# Altium schematic sheet NBT_JTAG_LOOP_CABLE.SCHDOC
size A4; Organization: Altium Limited; Address1: L3, 12a Rodborough Rd; Address2: Frenchs Forest; Address3: NSW; Address4: Australia 2086; DocumentNumber: 3; SheetNumber: 3; SheetTotal: 3
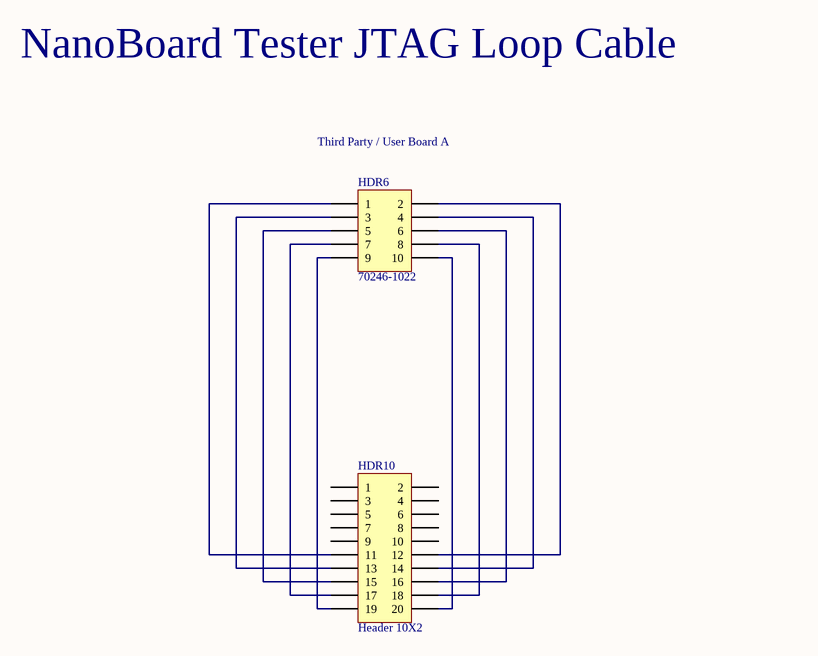
[diagram p0: NBT_JTAG_LOOP_CABLE.SCHDOC]

## Parts
HDR6  70246-1022  Usage: Third Party / User Board A  [HDR2X5_LP]
HDR10  Header 10X2  [HDR2X10]

## Nets
NetHDR6_1: HDR6.1 HDR10.11
NetHDR6_2: HDR6.2 HDR10.12
NetHDR6_3: HDR6.3 HDR10.13
NetHDR6_4: HDR6.4 HDR10.14
NetHDR6_5: HDR6.5 HDR10.15
NetHDR6_6: HDR6.6 HDR10.16
NetHDR6_7: HDR6.7 HDR10.17
NetHDR6_8: HDR6.8 HDR10.18
NetHDR6_9: HDR6.9 HDR10.19
NetHDR6_10: HDR6.10 HDR10.20

Not connected (* = marked no-connect by the designer): HDR10 1 2 3 4 5 6 7 8 9 10

## Notes on the sheet
- NanoBoard Tester JTAG Loop Cable
- Title
- Size:
- Date:
- A4
- Number:
- Time:
- Revision:
- Sheet
- of
- File:

## Library data of the parts
HDR6 = Header 5X2: Header, 5-Pin, Dual row; Manufacturer: Molex; Class I: Connector; Fitted: True; Revision: July-2002: Re-released for DXP Platform.; Publisher: Altium Limited
HDR10 = Header 10X2: Header, 10-Pin, Dual row; Manufacturer: Generic Components; Class I: Connector; Fitted: True; Revision: July-2002: Re-released for DXP Platform.; Publisher: Altium Limited